# Altium schematic sheet HIL.SchDoc
size 420 x 297 mm; DrawnBy: SAMY VE & VY TRAN; SheetNumber: 2; SheetTotal: 5
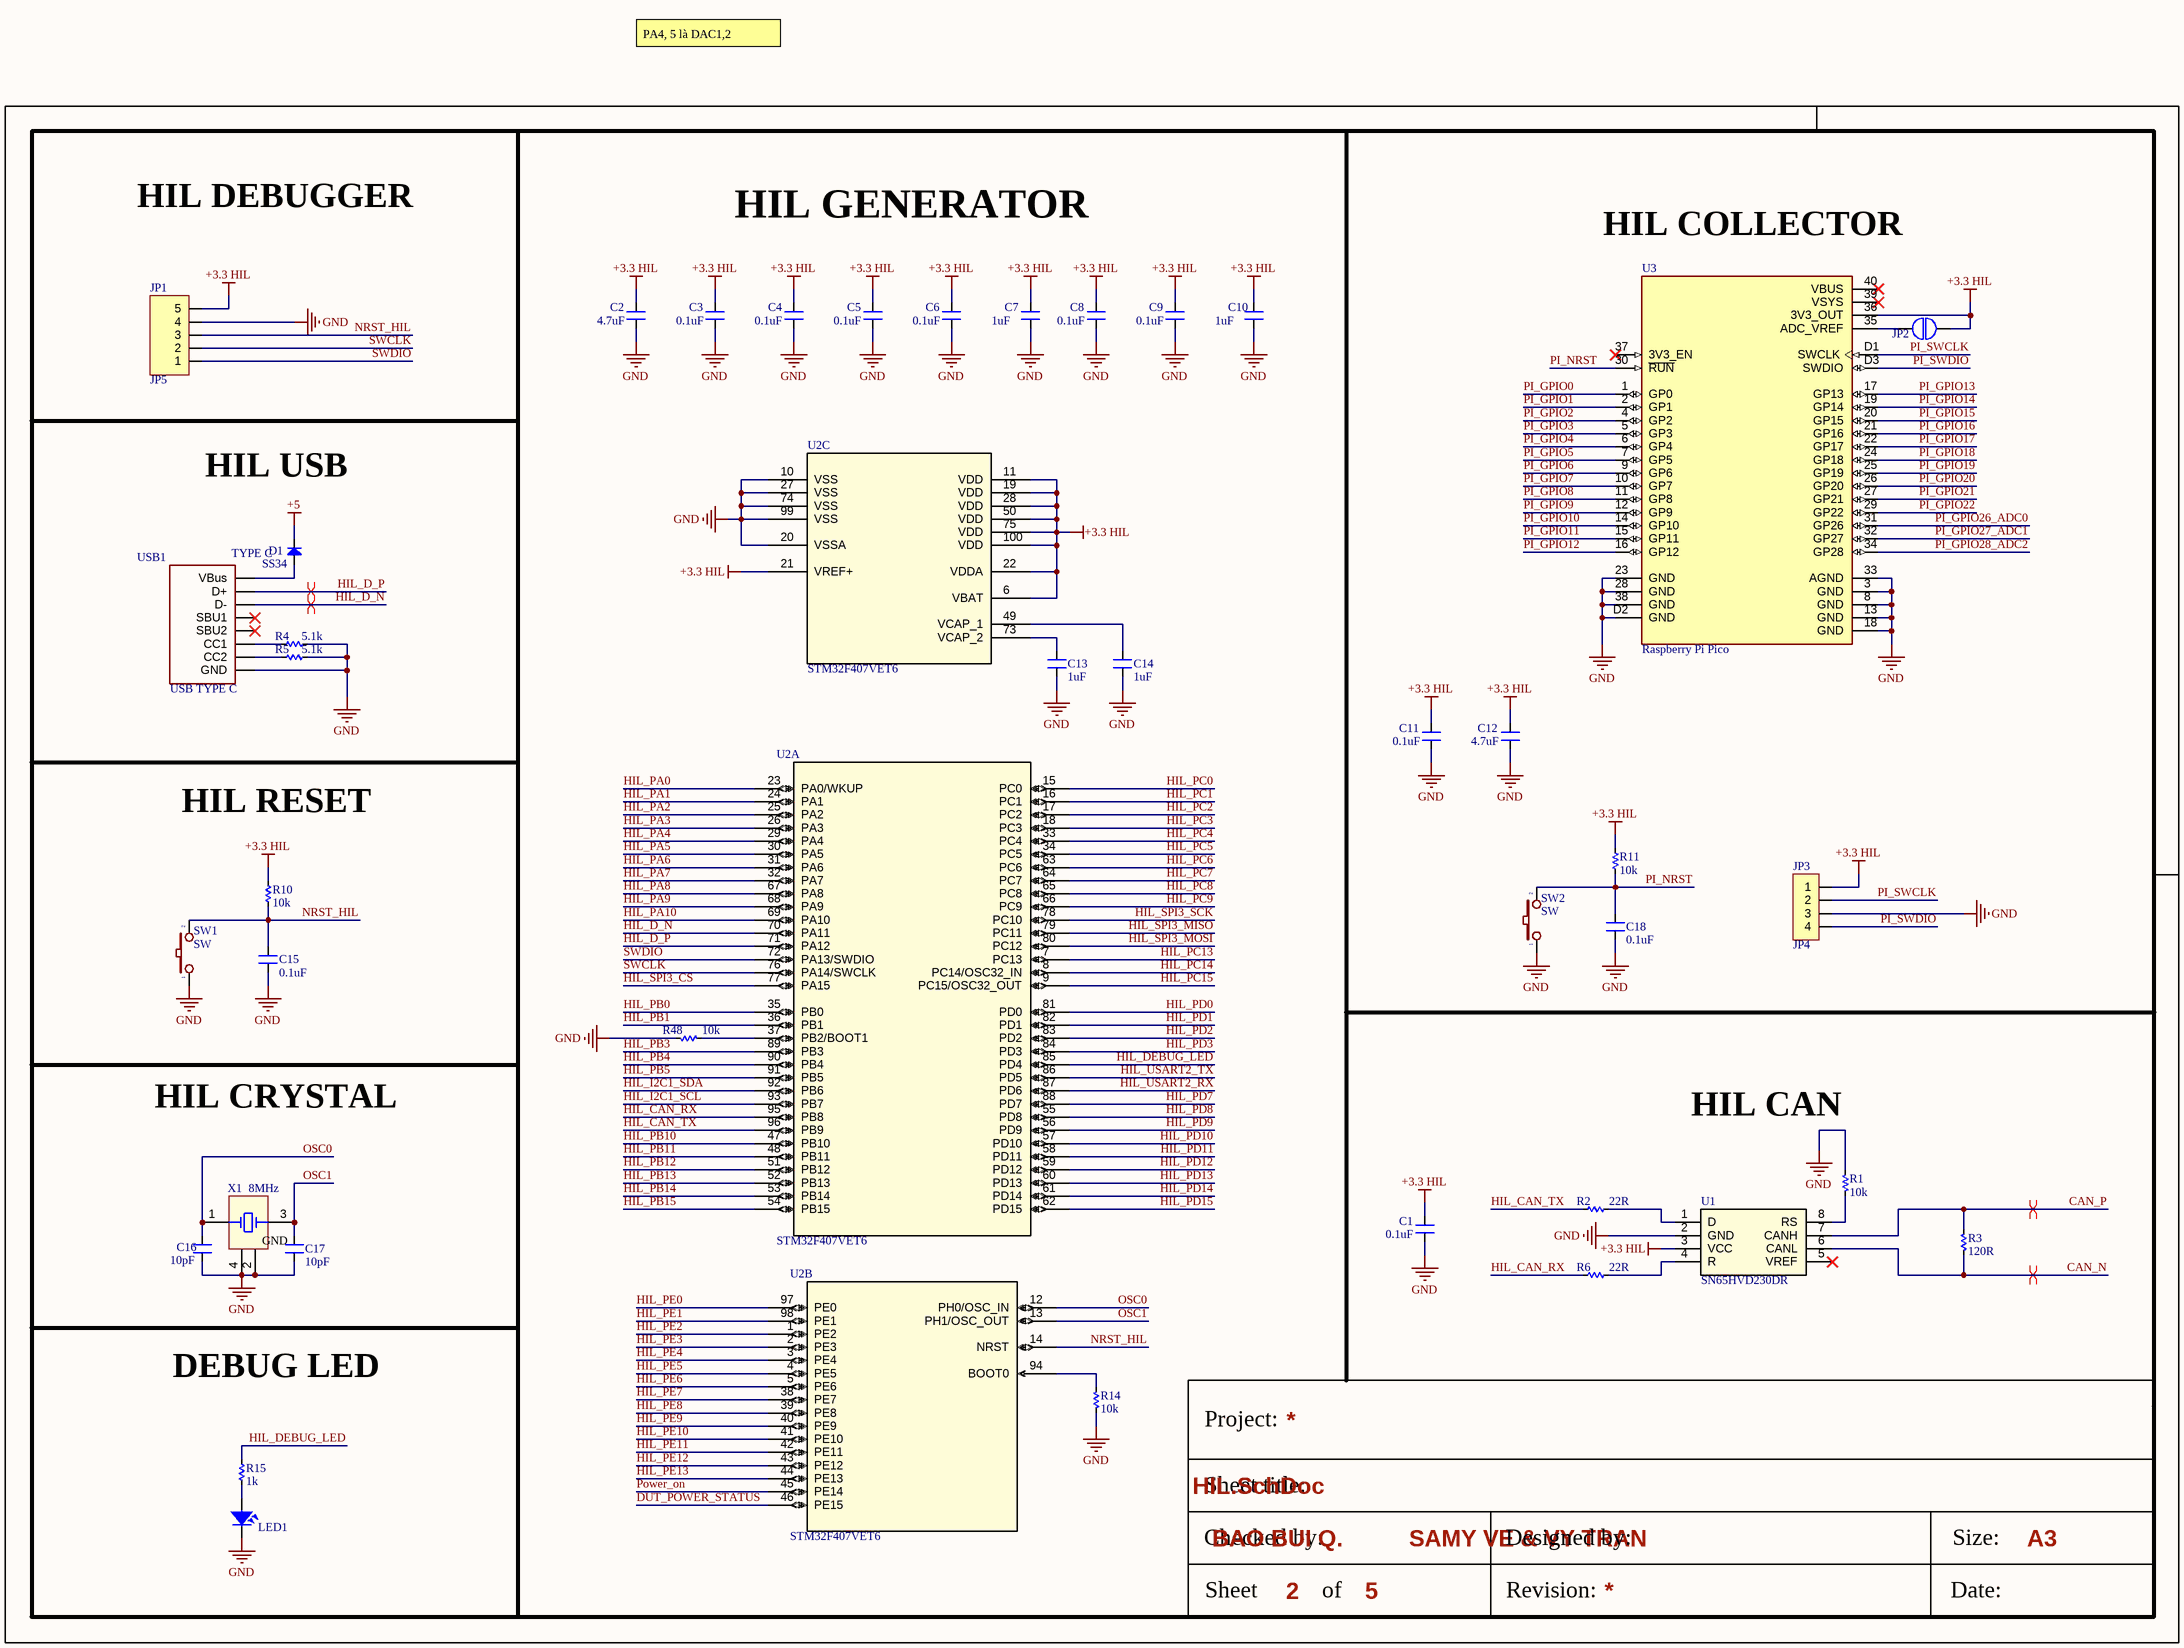
[diagram p0: HIL.SchDoc]

## Parts
C1  0.1uF  [CN-SMD-0603]
C2  4.7uF  [CN-SMD-0603]
C3  0.1uF  [CN-SMD-0603]
C4  0.1uF  [CN-SMD-0603]
C5  0.1uF  [CN-SMD-0603]
C6  0.1uF  [CN-SMD-0603]
C7  1uF  [CN-SMD-0603]
C8  0.1uF  [CN-SMD-0603]
C9  0.1uF  [CN-SMD-0603]
C10  1uF  [CN-SMD-0603]
C11  0.1uF  [CN-SMD-0603]
C12  4.7uF  [CN-SMD-0603]
C13  1uF  [CN-SMD-0603]
C14  1uF  [CN-SMD-0603]
C15  0.1uF  [CN-SMD-0603]
C16  10pF  [CN-SMD-0603]
C17  10pF  [CN-SMD-0603]
C18  0.1uF  [CN-SMD-0603]
D1  SS34  [DIO-SMD-A]
JP1  JP5  [JP5-D1C]
JP2  JUMP2  [Jump2]  (value not drawn)
JP3  JP4  [JP4-D1T]
LED1  LED  [LED-0805-Red]  (value not drawn)
R1  10k  [RES-SMD-0603]
R2  22R  [RES-SMD-0603]
R3  120R  [RES-SMD-0603]
R4  5.1k  [RES-SMD-0603]
R5  5.1k  [RES-SMD-0603]
R6  22R  [RES-SMD-0603]
R10  10k  [RES-SMD-0603]
R11  10k  [RES-SMD-0603]
R14  10k  [RES-SMD-0603]
R15  1k  [RES-SMD-0603]
R48  10k  [RES-SMD-0603]
SW1  SW  [SW1-SMD]
SW2  SW  [SW1-SMD]
U1  SN65HVD230DR  [SO8]
U2  STM32F407VET6  [LQFP100]  (parts A,B,C of 3)
U3  Raspberry Pi Pico  [Raspberry Pi Pico]
USB1  USB TYPE C  [TYPE C 16P]
X1  8MHz  [XT4-16.000MHz-4_V]

## Nets
+3.3 HIL: C1.1 C2.1 C3.1 C4.1 C5.1 C6.1 C7.1 C8.1 C9.1 C10.1 C11.1 C12.1 JP1.5 JP2.2 JP3.1 R10.1 R11.1 U1.3(VCC) U2.6(VBAT) U2.11(VDD) U2.19(VDD) U2.21(VREF+) U2.22(VDDA) U2.28(VDD) U2.50(VDD) U2.75(VDD) U2.100(VDD) U3.36(3V3_OUT)
+5: D1.2(K)
GND: C1.2 C2.2 C3.2 C4.2 C5.2 C6.2 C7.2 C8.2 C9.2 C10.2 C11.2 C12.2 C13.1 C14.1 C15.1 C16.1 C17.2 C18.1 JP1.4 JP3.3 LED1.2 R1.1 R4.2 R5.2 R14.2 R48.1 SW1.1 SW2.1 U1.2(GND) U2.10(VSS) U2.20(VSSA) U2.27(VSS) U2.74(VSS) U2.99(VSS) U3.3(GND) U3.8(GND) U3.13(GND) U3.18(GND) U3.23(GND) U3.28(GND) U3.33(AGND) U3.38(GND) U3.D2(GND) USB1.A1,A12,B1,B12,SHIELD(GND) X1.2(GND) X1.4(GND)
CAN_N: R3.2 U1.6(CANL)
CAN_P: R3.1 U1.7(CANH)
DUT_POWER_STATUS: U2.46(PE15)
HIL_CAN_RX: R6.2 U2.95(PB8)
HIL_CAN_TX: R2.2 U2.96(PB9)
HIL_D_N: U2.70(PA11) USB1.A7,B7(D-)
HIL_D_P: U2.71(PA12) USB1.A6,B6(D+)
HIL_DEBUG_LED: R15.2 U2.85(PD4)
HIL_I2C1_SCL: U2.93(PB7)
HIL_I2C1_SDA: U2.92(PB6)
HIL_PA0: U2.23(PA0/WKUP)
HIL_PA1: U2.24(PA1)
HIL_PA2: U2.25(PA2)
HIL_PA3: U2.26(PA3)
HIL_PA4: U2.29(PA4)
HIL_PA5: U2.30(PA5)
HIL_PA6: U2.31(PA6)
HIL_PA7: U2.32(PA7)
HIL_PA8: U2.67(PA8)
HIL_PA9: U2.68(PA9)
HIL_PA10: U2.69(PA10)
HIL_PB0: U2.35(PB0)
HIL_PB1: U2.36(PB1)
HIL_PB3: U2.89(PB3)
HIL_PB4: U2.90(PB4)
HIL_PB5: U2.91(PB5)
HIL_PB10: U2.47(PB10)
HIL_PB11: U2.48(PB11)
HIL_PB12: U2.51(PB12)
HIL_PB13: U2.52(PB13)
HIL_PB14: U2.53(PB14)
HIL_PB15: U2.54(PB15)
HIL_PC0: U2.15(PC0)
HIL_PC1: U2.16(PC1)
HIL_PC2: U2.17(PC2)
HIL_PC3: U2.18(PC3)
HIL_PC4: U2.33(PC4)
HIL_PC5: U2.34(PC5)
HIL_PC6: U2.63(PC6)
HIL_PC7: U2.64(PC7)
HIL_PC8: U2.65(PC8)
HIL_PC9: U2.66(PC9)
HIL_PC13: U2.7(PC13)
HIL_PC14: U2.8(PC14/OSC32_IN)
HIL_PC15: U2.9(PC15/OSC32_OUT)
HIL_PD0: U2.81(PD0)
HIL_PD1: U2.82(PD1)
HIL_PD2: U2.83(PD2)
HIL_PD3: U2.84(PD3)
HIL_PD7: U2.88(PD7)
HIL_PD8: U2.55(PD8)
HIL_PD9: U2.56(PD9)
HIL_PD10: U2.57(PD10)
HIL_PD11: U2.58(PD11)
HIL_PD12: U2.59(PD12)
HIL_PD13: U2.60(PD13)
HIL_PD14: U2.61(PD14)
HIL_PD15: U2.62(PD15)
HIL_PE0: U2.97(PE0)
HIL_PE1: U2.98(PE1)
HIL_PE2: U2.1(PE2)
HIL_PE3: U2.2(PE3)
HIL_PE4: U2.3(PE4)
HIL_PE5: U2.4(PE5)
HIL_PE6: U2.5(PE6)
HIL_PE7: U2.38(PE7)
HIL_PE8: U2.39(PE8)
HIL_PE9: U2.40(PE9)
HIL_PE10: U2.41(PE10)
HIL_PE11: U2.42(PE11)
HIL_PE12: U2.43(PE12)
HIL_PE13: U2.44(PE13)
HIL_SPI3_CS: U2.77(PA15)
HIL_SPI3_MISO: U2.79(PC11)
HIL_SPI3_MOSI: U2.80(PC12)
HIL_SPI3_SCK: U2.78(PC10)
HIL_USART2_RX: U2.87(PD6)
HIL_USART2_TX: U2.86(PD5)
NRST_HIL: C15.2 JP1.3 R10.2 SW1.2 U2.14(NRST)
OSC0: C16.2 U2.12(PH0/OSC_IN) X1.1(XTAL)
OSC1: C17.1 U2.13(PH1/OSC_OUT) X1.3(XTAL)
PI_GPIO0: U3.1(GP0)
PI_GPIO1: U3.2(GP1)
PI_GPIO2: U3.4(GP2)
PI_GPIO3: U3.5(GP3)
PI_GPIO4: U3.6(GP4)
PI_GPIO5: U3.7(GP5)
PI_GPIO6: U3.9(GP6)
PI_GPIO7: U3.10(GP7)
PI_GPIO8: U3.11(GP8)
PI_GPIO9: U3.12(GP9)
PI_GPIO10: U3.14(GP10)
PI_GPIO11: U3.15(GP11)
PI_GPIO12: U3.16(GP12)
PI_GPIO13: U3.17(GP13)
PI_GPIO14: U3.19(GP14)
PI_GPIO15: U3.20(GP15)
PI_GPIO16: U3.21(GP16)
PI_GPIO17: U3.22(GP17)
PI_GPIO18: U3.24(GP18)
PI_GPIO19: U3.25(GP19)
PI_GPIO20: U3.26(GP20)
PI_GPIO21: U3.27(GP21)
PI_GPIO22: U3.29(GP22)
PI_GPIO26_ADC0: U3.31(GP26)
PI_GPIO27_ADC1: U3.32(GP27)
PI_GPIO28_ADC2: U3.34(GP28)
PI_NRST: C18.2 R11.2 SW2.2 U3.30(~{RUN})
PI_SWCLK: JP3.2 U3.D1(SWCLK)
PI_SWDIO: JP3.4 U3.D3(SWDIO)
Power_on: U2.45(PE14)
SWCLK: JP1.2 U2.76(PA14/SWCLK)
SWDIO: JP1.1 U2.72(PA13/SWDIO)
NetC13_2: C13.2 U2.73(VCAP_2)
NetC14_2: C14.2 U2.49(VCAP_1)
NetD1_1: D1.1(A) USB1.A4,A9,B4,B9(VBus)
NetJP2_1: JP2.1 U3.35(ADC_VREF)
NetLED1_1: LED1.1 R15.1
NetR1_2: R1.2 U1.8(RS)
NetR2_1: R2.1 U1.1(D)
NetR4_1: R4.1 USB1.A5(CC1)
NetR5_1: R5.1 USB1.B5(CC2)
NetR6_1: R6.1 U1.4(R)
NetR14_1: R14.1 U2.94(BOOT0)
NetR48_2: R48.2 U2.37(PB2/BOOT1)

Not connected (* = marked no-connect by the designer): U1 5(VREF)*; U3 37(3V3_EN)* 39(VSYS)* 40(VBUS)*; USB1 A8(SBU1)* B8(SBU2)*

## Layout directives
differential pair: CAN_N, CAN_P, HIL_D_N, HIL_D_P

## Notes on the sheet
- PA4, 5 là DAC1,2
- HIL DEBUGGER
- HIL GENERATOR
- (near U3) HIL COLLECTOR
- HIL USB
- HIL RESET
- HIL CRYSTAL
- HIL CAN
- DEBUG LED
- Project:
- Sheet title:
- BAO BUI Q.
- SAMY VE & VY TRAN
- A3
- Sheet
- Checked by:
- of
- Revision:
- Designed by:
- Size:
- Date:
- (in symbol USB TYPE C) TYPE C

## Library data of the parts
C1-C18 = CN: Value: 33pF
D1 = Diode SMD: Default Diode; Code - JEDEC: DO-214-AB; Value: 1N5007; Published: 8-Jun-2000; Revision: July-2002: Re-released for DXP Platform.; Publisher: Altium Limited
JP1 = JP5: WR-PHD 2.54 mm Angled Socket Header; Manufacturer: W¨¹rth Elektronik eiSos GmbH; partNo: 613005143121; ComponentLink1 Description: Manufacturer; ComponentLink2 Description: Datasheet; NoPins: 05; Created Date: 29 March 2013; ComponentLink1URL: http://www.we-online.com; ComponentLink2URL: http://katalog.we-online.de/em/datasheet/6130xx143121.pdf; Created by: Karrer Zheng
JP3 = JP4: WR-PHD 2.54 mm Angled Socket Header; Manufacturer: W¨¹rth Elektronik eiSos GmbH; partNo: 613004143121; ComponentLink1 Description: Manufacturer; ComponentLink2 Description: Datasheet; NoPins: 04; Created Date: 29 March 2013; ComponentLink1URL: http://www.we-online.com; ComponentLink2URL: http://katalog.we-online.de/em/datasheet/6130xx143121.pdf; Created by: Karrer Zheng
LED1 = LED SMD: Value: LED 3 - 5 ly 2 Colour
R1-R6 R10 R11 R14 R15 R48 = Res-SMD: Resistor; Manufacturer: Generic Components; Class: Passive; Published: 08/06/2000; Publisher: Altium Hobart Technology Centre
SW1 SW2 = SW2: Switch button 2 pin; Value: SW chip 2 pin
U1 = SN65HVD251DR: IC TRANSCEIVER HALF 1/1 8SOIC
U2 = STM32F407VET6: High-performance foundation line, ARM Cortex-M4 core with DSP and FPU, 1 Mbyte Flash, 168 MHz CPU, ART Accelerator; Mfr_Name: STMicroelectronics; RefDes: RefDes; Type: Type
X1 = XT4: Crystal, 16 MHz, -30 to 85 degC, 3.2 x 2.5 x 0.9 mm SMD; Value: 4Mhz